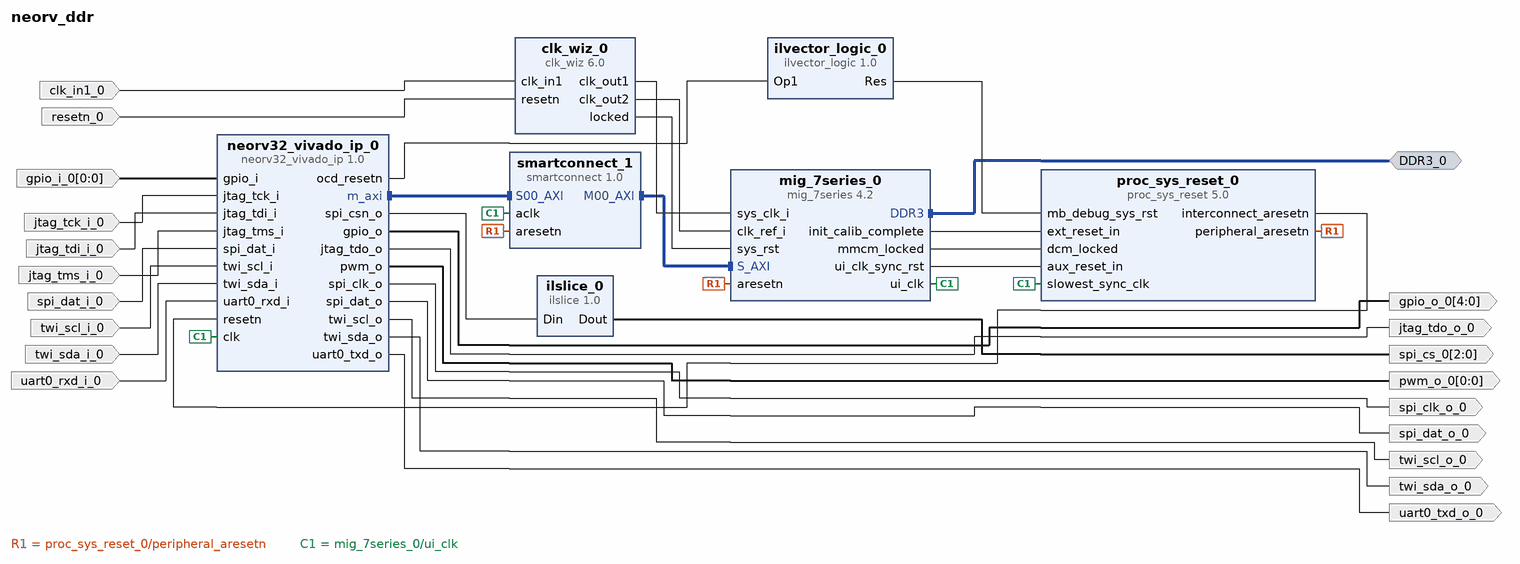
[diagram p0: block diagram of the top level]
# Vivado block design neorv_ddr, xc7a100tfgg484-2, Vivado 2025.2
create_bd_design neorv_ddr

create_bd_intf_port -mode Master -vlnv xilinx.com:interface:ddrx_rtl:1.0 DDR3_0
create_bd_port -dir I -type rst resetn_0
create_bd_port -dir I -type clk clk_in1_0
create_bd_port -dir I jtag_tck_i_0
create_bd_port -dir I jtag_tdi_i_0
create_bd_port -dir I jtag_tms_i_0
create_bd_port -dir I uart0_rxd_i_0
create_bd_port -dir I twi_sda_i_0
create_bd_port -dir I twi_scl_i_0
create_bd_port -dir O twi_scl_o_0
create_bd_port -dir O twi_sda_o_0
create_bd_port -dir O uart0_txd_o_0
create_bd_port -dir O jtag_tdo_o_0
create_bd_port -dir O spi_clk_o_0
create_bd_port -dir O spi_dat_o_0
create_bd_port -dir I spi_dat_i_0
create_bd_port -dir O -from 0 -to 0 pwm_o_0
create_bd_port -dir I -from 0 -to 0 gpio_i_0
create_bd_port -dir O -from 4 -to 0 gpio_o_0
create_bd_port -dir O -from 2 -to 0 spi_cs_0

create_bd_cell -type ip -vlnv NEORV32:user:neorv32_vivado_ip:1.0 neorv32_vivado_ip_0
set_property -dict [list \
  CONFIG.CPU_FAST_MUL_EN true \
  CONFIG.CPU_FAST_SHIFT_EN true \
  CONFIG.CPU_RF_ARCH_SEL 0 \
  CONFIG.DCACHE_EN true \
  CONFIG.DMEM_EN false \
  CONFIG.DUAL_CORE_EN false \
  CONFIG.ICACHE_EN true \
  CONFIG.IMEM_EN true \
  CONFIG.IMEM_SIZE 131072 \
  CONFIG.IO_CLINT_EN false \
  CONFIG.IO_DMA_EN true \
  CONFIG.IO_GPIO_EN true \
  CONFIG.IO_GPIO_IN_NUM 1 \
  CONFIG.IO_GPIO_OUT_NUM 5 \
  CONFIG.IO_PWM_EN true \
  CONFIG.IO_SLINK_EN false \
  CONFIG.IO_SPI_EN true \
  CONFIG.IO_SPI_FIFO 3 \
  CONFIG.IO_TWI_EN true \
  CONFIG.IO_UART0_EN true \
  CONFIG.IO_UART0_RX_FIFO 8 \
  CONFIG.IO_UART0_TX_FIFO 8 \
  CONFIG.IO_UART1_EN false \
  CONFIG.OCD_EN true \
  CONFIG.RISCV_ISA_C true \
  CONFIG.RISCV_ISA_M true \
  CONFIG.RISCV_ISA_Zibi true \
  CONFIG.RISCV_ISA_Zicntr false \
  CONFIG.RISCV_ISA_Zicond true \
  CONFIG.XBUS_EN true \
  CONFIG.XBUS_REGSTAGE_EN false \
] [get_bd_cells neorv32_vivado_ip_0]
create_bd_cell -type ip -vlnv xilinx.com:ip:clk_wiz:6.0 clk_wiz_0
set_property -dict [list \
  CONFIG.CLKOUT1_JITTER 130.958 \
  CONFIG.CLKOUT1_PHASE_ERROR 98.575 \
  CONFIG.CLKOUT2_JITTER 114.829 \
  CONFIG.CLKOUT2_PHASE_ERROR 98.575 \
  CONFIG.CLKOUT2_REQUESTED_OUT_FREQ 200 \
  CONFIG.CLKOUT2_USED true \
  CONFIG.CLKOUT3_JITTER 153.172 \
  CONFIG.CLKOUT3_PHASE_ERROR 79.592 \
  CONFIG.CLKOUT3_REQUESTED_OUT_FREQ 12.288 \
  CONFIG.CLKOUT3_USED false \
  CONFIG.CLKOUT4_JITTER 132.886 \
  CONFIG.CLKOUT4_PHASE_ERROR 79.592 \
  CONFIG.CLKOUT4_REQUESTED_OUT_FREQ 24.576 \
  CONFIG.CLKOUT4_USED false \
  CONFIG.MMCM_CLKFBOUT_MULT_F 10.000 \
  CONFIG.MMCM_CLKOUT0_DIVIDE_F 10.000 \
  CONFIG.MMCM_CLKOUT1_DIVIDE 5 \
  CONFIG.MMCM_CLKOUT2_DIVIDE 1 \
  CONFIG.MMCM_CLKOUT3_DIVIDE 1 \
  CONFIG.NUM_OUT_CLKS 2 \
  CONFIG.RESET_PORT resetn \
  CONFIG.RESET_TYPE ACTIVE_LOW \
] [get_bd_cells clk_wiz_0]
create_bd_cell -type ip -vlnv xilinx.com:ip:mig_7series:4.2 mig_7series_0
set_property -dict [list \
  CONFIG.BOARD_MIG_PARAM Custom \
  CONFIG.MIG_DONT_TOUCH_PARAM Custom \
  CONFIG.RESET_BOARD_INTERFACE Custom \
  CONFIG.XML_INPUT_FILE mig_a.prj \
] [get_bd_cells mig_7series_0]
create_bd_cell -type ip -vlnv xilinx.com:ip:proc_sys_reset:5.0 proc_sys_reset_0
set_property -dict {CONFIG.C_AUX_RESET_HIGH 1} [get_bd_cells proc_sys_reset_0]
create_bd_cell -type ip -vlnv xilinx.com:ip:smartconnect:1.0 smartconnect_1
set_property -dict {CONFIG.NUM_CLKS 1 CONFIG.NUM_MI 1 CONFIG.NUM_SI 1} [get_bd_cells smartconnect_1]
create_bd_cell -type inline_hdl -vlnv xilinx.com:inline_hdl:ilvector_logic:1.0 ilvector_logic_0
set_property -dict {CONFIG.C_OPERATION not CONFIG.C_SIZE 1} [get_bd_cells ilvector_logic_0]
create_bd_cell -type inline_hdl -vlnv xilinx.com:inline_hdl:ilslice:1.0 ilslice_0
set_property -dict {CONFIG.DIN_FROM 2 CONFIG.DIN_WIDTH 8} [get_bd_cells ilslice_0]

# ---- connections ----

connect_bd_intf_net [get_bd_intf_ports DDR3_0] [get_bd_intf_pins mig_7series_0/DDR3]
connect_bd_intf_net [get_bd_intf_pins smartconnect_1/S00_AXI] [get_bd_intf_pins neorv32_vivado_ip_0/m_axi]
connect_bd_intf_net [get_bd_intf_pins smartconnect_1/M00_AXI] [get_bd_intf_pins mig_7series_0/S_AXI]
connect_bd_net [get_bd_pins proc_sys_reset_0/peripheral_aresetn] [get_bd_pins mig_7series_0/aresetn] [get_bd_pins smartconnect_1/aresetn]
connect_bd_net -net clk_in1_0_1 [get_bd_ports clk_in1_0] [get_bd_pins clk_wiz_0/clk_in1]
connect_bd_net [get_bd_pins clk_wiz_0/clk_out1] [get_bd_pins mig_7series_0/sys_clk_i]
connect_bd_net [get_bd_pins clk_wiz_0/clk_out2] [get_bd_pins mig_7series_0/clk_ref_i]
connect_bd_net [get_bd_pins clk_wiz_0/locked] [get_bd_pins mig_7series_0/sys_rst]
connect_bd_net -net gpio_i_0_1 [get_bd_ports gpio_i_0] [get_bd_pins neorv32_vivado_ip_0/gpio_i]
connect_bd_net [get_bd_pins ilslice_0/Dout] [get_bd_ports spi_cs_0]
connect_bd_net [get_bd_pins ilvector_logic_0/Res] [get_bd_pins proc_sys_reset_0/mb_debug_sys_rst]
connect_bd_net -net jtag_tck_i_0_1 [get_bd_ports jtag_tck_i_0] [get_bd_pins neorv32_vivado_ip_0/jtag_tck_i]
connect_bd_net -net jtag_tdi_i_0_1 [get_bd_ports jtag_tdi_i_0] [get_bd_pins neorv32_vivado_ip_0/jtag_tdi_i]
connect_bd_net -net jtag_tms_i_0_1 [get_bd_ports jtag_tms_i_0] [get_bd_pins neorv32_vivado_ip_0/jtag_tms_i]
connect_bd_net [get_bd_pins mig_7series_0/init_calib_complete] [get_bd_pins proc_sys_reset_0/ext_reset_in]
connect_bd_net [get_bd_pins mig_7series_0/mmcm_locked] [get_bd_pins proc_sys_reset_0/dcm_locked]
connect_bd_net [get_bd_pins mig_7series_0/ui_clk] \
  [get_bd_pins neorv32_vivado_ip_0/clk] [get_bd_pins proc_sys_reset_0/slowest_sync_clk] [get_bd_pins smartconnect_1/aclk]
connect_bd_net [get_bd_pins mig_7series_0/ui_clk_sync_rst] [get_bd_pins proc_sys_reset_0/aux_reset_in]
connect_bd_net [get_bd_pins neorv32_vivado_ip_0/gpio_o] [get_bd_ports gpio_o_0]
connect_bd_net [get_bd_pins neorv32_vivado_ip_0/jtag_tdo_o] [get_bd_ports jtag_tdo_o_0]
connect_bd_net [get_bd_pins neorv32_vivado_ip_0/ocd_resetn] [get_bd_pins ilvector_logic_0/Op1]
connect_bd_net [get_bd_pins neorv32_vivado_ip_0/pwm_o] [get_bd_ports pwm_o_0]
connect_bd_net [get_bd_pins neorv32_vivado_ip_0/spi_clk_o] [get_bd_ports spi_clk_o_0]
connect_bd_net [get_bd_pins neorv32_vivado_ip_0/spi_csn_o] [get_bd_pins ilslice_0/Din]
connect_bd_net [get_bd_pins neorv32_vivado_ip_0/spi_dat_o] [get_bd_ports spi_dat_o_0]
connect_bd_net [get_bd_pins neorv32_vivado_ip_0/twi_scl_o] [get_bd_ports twi_scl_o_0]
connect_bd_net [get_bd_pins neorv32_vivado_ip_0/twi_sda_o] [get_bd_ports twi_sda_o_0]
connect_bd_net [get_bd_pins neorv32_vivado_ip_0/uart0_txd_o] [get_bd_ports uart0_txd_o_0]
connect_bd_net [get_bd_pins proc_sys_reset_0/interconnect_aresetn] [get_bd_pins neorv32_vivado_ip_0/resetn]
connect_bd_net -net resetn_0_1 [get_bd_ports resetn_0] [get_bd_pins clk_wiz_0/resetn]
connect_bd_net -net spi_dat_i_0_1 [get_bd_ports spi_dat_i_0] [get_bd_pins neorv32_vivado_ip_0/spi_dat_i]
connect_bd_net -net twi_scl_i_0_1 [get_bd_ports twi_scl_i_0] [get_bd_pins neorv32_vivado_ip_0/twi_scl_i]
connect_bd_net -net twi_sda_i_0_1 [get_bd_ports twi_sda_i_0] [get_bd_pins neorv32_vivado_ip_0/twi_sda_i]
connect_bd_net -net uart0_rxd_i_0_1 [get_bd_ports uart0_rxd_i_0] [get_bd_pins neorv32_vivado_ip_0/uart0_rxd_i]

# ---- address map ----
assign_bd_address -offset 0x80000000 -range 256M -target_address_space [get_bd_addr_spaces neorv32_vivado_ip_0/m_axi] [get_bd_addr_segs mig_7series_0/memmap/memaddr]

validate_bd_design
save_bd_design
